# Altium schematic sheet ESP-12MOD.SchDoc
size A
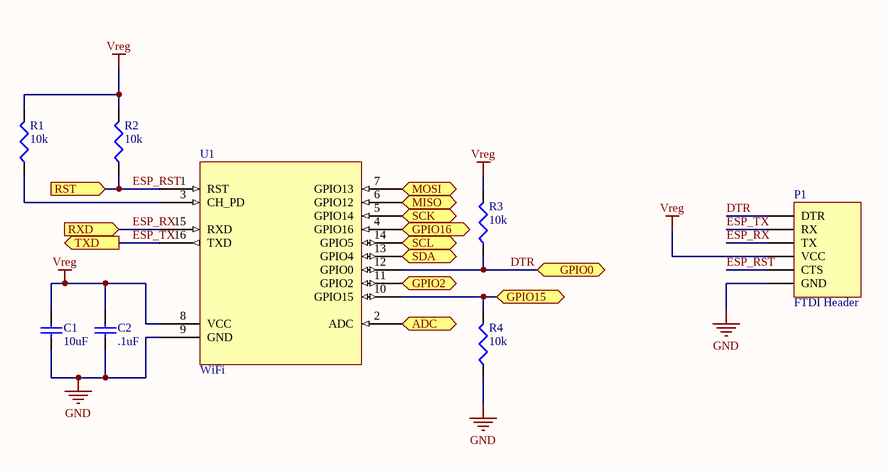
[diagram p0: ESP-12MOD.SchDoc]

## Parts
C1  value 10uF  [1608[0603]]  (hidden comment: Cap)
C2  value .1uF  [1608[0603]]  (hidden comment: Cap)
P1  FTDI Header  [HDR1X6]
R1  value 10k  [J1-0603]  (hidden comment: Res3)
R2  value 10k  [J1-0603]  (hidden comment: Res3)
R3  value 10k  [J1-0603]  (hidden comment: Res3)
R4  value 10k  [J1-0603]  (hidden comment: Res3)
U1  WiFi  [ESP8266ShieldedSMD]

## Ports
ADC (bidir), GPIO0 (bidir), GPIO2 (bidir), GPIO15 (bidir), GPIO16 (bidir), MISO (in), MOSI (out), RST (in), RXD (in), SCK (out), SCL (bidir), SDA (bidir), TXD (out)

## Nets
GND: C1.1 C2.1 P1.6(GND) R4.1 U1.9(GND)
Vreg: C1.2 C2.2 P1.4(VCC) R1.2 R2.2 R3.2 U1.8(VCC)
ADC: U1.2(ADC) ; port ADC
DTR: P1.1(DTR) R3.1 U1.12(GPIO0) ; port GPIO0
ESP_RST: P1.5(CTS) R2.1 U1.1(RST) ; port RST
ESP_RX: P1.3(TX) U1.15(RXD) ; port RXD
ESP_TX: P1.2(RX) U1.16(TXD) ; port TXD
GPIO2: U1.11(GPIO2) ; port GPIO2
GPIO15: R4.2 U1.10(GPIO15) ; port GPIO15
GPIO16: U1.4(GPIO16) ; port GPIO16
MISO: U1.6(GPIO12) ; port MISO
MOSI: U1.7(GPIO13) ; port MOSI
SCK: U1.5(GPIO14) ; port SCK
SCL: U1.14(GPIO5) ; port SCL
SDA: U1.13(GPIO4) ; port SDA
NetR1_1: R1.1 U1.3(CH_PD)

## Library data of the parts
C1 C2 = Cap Semi: Published: 8-Jun-2000; LatestRevisionDate: 29-May-2009; LatestRevisionNote: IPC-7351 Footprint Added.; PackageReference: C1206; Publisher: Altium Limited; PackageDescription: Chip Capacitor
P1 = FTDI Header: Header, 6-Pin; LatestRevisionDate: 17-Jul-2002; LatestRevisionNote: Re-released for DXP Platform.; Publisher: Altium Limited
R1-R4 = Res3: Resistor; Published: 8-Jun-2000; LatestRevisionDate: 29-May-2009; LatestRevisionNote: IPC-7351 Footprint Added.; PackageReference: J1-0603; Publisher: Altium Limited; PackageDescription: Chip Resistor
U1 = ESP8266-Shielded